# Altium schematic sheet StateMachine.SchDoc
size A4; SheetNumber: 8; SheetTotal: 12
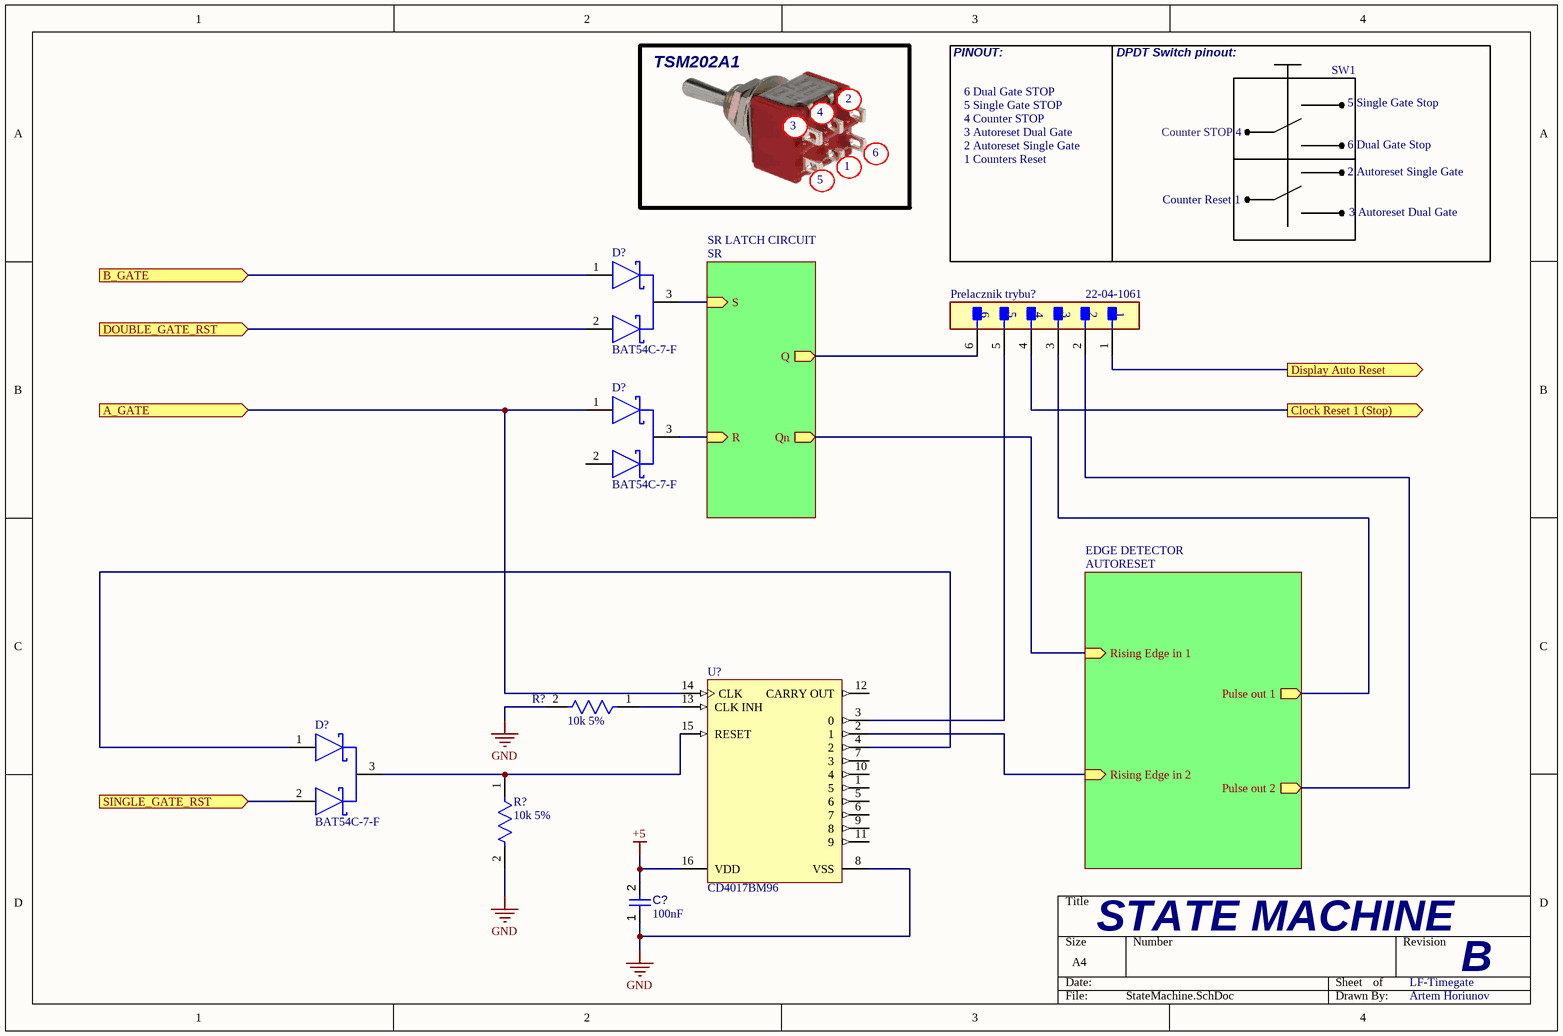
[diagram p0: StateMachine.SchDoc]

## Parts
(Parts that share a designator on the sheet are numbered #1, #2 ... from top to bottom, then left to right.)
C?  value 100nF  [CAPC2013X95X50LL10T25]  (hidden comment: Capacitor 100 nF +/-10% 50 V 0805)
D?#1  BAT54C-7-F  [FP-SOT23-IPC_B]
D?#2  BAT54C-7-F  [FP-SOT23-IPC_B]
D?#3  BAT54C-7-F  [FP-SOT23-IPC_B]
Prelacznik_trybu?  22-04-1061  [FP-22-04-1061-MFG]
R?#1  10k 5%  [FP-RC0603-0_55-IPC_C]
R?#2  10k 5%  [FP-RC0603-0_55-IPC_C]
U?  CD4017BM96  [D0016A_L]

## Sub-sheets
EDGE DETECTOR = AUTORESET: Rising Edge in 1 (in), Rising Edge in 2 (in), Pulse out 1 (out), Pulse out 2 (out)
SR LATCH CIRCUIT = SR: S (in), R (in), Q (out), Qn (out)

## Ports
A_GATE (in), B_GATE (in), Clock Reset 1 (Stop) (out), Display Auto Reset (out), DOUBLE_GATE_RST (in), SINGLE_GATE_RST (in)

## Nets
+5: C?.2 U?.16(VDD)
GND: C?.1 R?#1.2 R?#2.2 U?.8(VSS)
A_GATE: D?#2.1(1_ANODE) U?.14(CLK) ; port A_GATE
B_GATE: D?#1.1(1_ANODE) ; port B_GATE
Clock Reset 1 (Stop): Prelacznik_trybu?.4 ; port Clock Reset 1 (Stop)
Display Auto Reset: Prelacznik_trybu?.1 ; port Display Auto Reset
DOUBLE_GATE_RST: D?#1.2(2_ANODE) ; port DOUBLE_GATE_RST
SINGLE_GATE_RST: D?#3.2(2_ANODE) ; port SINGLE_GATE_RST
NetD?#1_3: D?#1.3(COMMON_CATHODE) ; sheet SR LATCH CIRCUIT/S
NetD?#2_3: D?#2.3(COMMON_CATHODE) ; sheet SR LATCH CIRCUIT/R
NetD?#3_1: D?#3.1(1_ANODE) U?.4(2)
NetD?#3_3: D?#3.3(COMMON_CATHODE) R?#2.1 U?.15(RESET)
NetPrelacznik_trybu?_2: Prelacznik_trybu?.2 ; sheet EDGE DETECTOR/Pulse out 2
NetPrelacznik_trybu?_3: Prelacznik_trybu?.3 ; sheet EDGE DETECTOR/Pulse out 1
NetPrelacznik_trybu?_5: Prelacznik_trybu?.5 U?.3(0)
NetPrelacznik_trybu?_6: Prelacznik_trybu?.6 ; sheet SR LATCH CIRCUIT/Q
NetR?#1_1: R?#1.1 U?.13(CLK_INH)
NetU?_2: U?.2(1) ; sheet EDGE DETECTOR/Rising Edge in 2
(unnamed): sheet SR LATCH CIRCUIT/Qn, sheet EDGE DETECTOR/Rising Edge in 1

Not connected (* = marked no-connect by the designer): D?#2 2(2_ANODE); U? 1(5) 5(6) 6(7) 7(3) 9(8) 10(4) 11(9) 12(CARRY_OUT)

## Notes on the sheet
- TSM202A1
- 4
- 2
- PINOUT:
- 6 Dual Gate STOP
- 5 Single Gate STOP
- DPDT Switch pinout:
- SW1
- 5 Single Gate Stop
- 3
- 1
- 6
- 4 Counter STOP
- 3 Autoreset Dual Gate
- 2 Autoreset Single Gate
- 1 Counters Reset
- Counter STOP 4
- 6 Dual Gate Stop
- 5
- Counter Reset 1
- STATE MACHINE
- LF-Timegate
- B
- Artem Horiunov

## Library data of the parts
C? = CMP-001-00018-6: Chip Capacitor, 100 nF, +/- 10%, 50 V, 0805 (2012 Metric); Capacitor Type: Ceramic; Voltage Rating: 50V; Pins: 2; Max Operating Temperature: 125°C; Min Operating Temperature: -55°C; Mounting Technology: SM; Case/Package: 0805; RoHS Compliant: True; Tolerance: 10%
D?#1-D?#3 = CMP-12790-000084-1: DIODE ARRAY SCHOTTKY 30V SOT23-3; Max Reverse Current: 2uA; Power Dissipation: 200mW; Average Rectified Current: 200mA; Capacitance: 10pF; Peak Non-Repetitive Surge Current: 600mA; Forward Voltage: 800mV; Reverse Recovery Time: 5ns; Element Configuration: Common Cathode; Max Operating Temperature: 150°C; Max Reverse Voltage (DC): 30V; Power Rating: 200mW; Termination: SMD/SMT; REACH SVHC: No SVHC; Voltage Rating (DC): 30V; Series: -; Current Rating: 200mA; RoHS Compliant: Yes; Max Power Dissipation: 200mW; Case/Package: SOT-23; Max Repetitive Reverse Voltage (Vrrm): 30V; Width: 1.3mm; Min Operating Temperature: -65°C; Lead Free: Lead Free; Forward Current: 200mA; Number of Pins: 3; Contact Plating: Tin; Package Quantity: 3000; Length: 2.9mm; Radiation Hardening: No; Max Forward Surge Current (Ifsm): 600mA; Height: 1mm; Packaging: Tape and Reel; Mount: Surface Mount; Weight: 0.000282oz
Prelacznik_trybu? = CMP-04776-000934-1: CONN HEADER VERT 6POS 2.5MM; Number of Positions: 6; Contact Resistance: 20mR; Insulation Resistance: 1GR; Glow Wire Compliant: Non-compliant; Current Rating: 3A; Max Voltage Rating (DC): 250.25kV; Voltage Rating (AC): 250V; Connector Type: Male Pin; Gender: Male; Hole Diameter: 1.19mm; Termination: Solder; Number of Circuits: 6; Number of Rows: 1; Mount: Through Hole; Lead Free: Lead Free; Contact Type: Male Pin; Lead Pitch: 2.5mm; Radiation Hardening: No; Packaging: Bulk; Pitch: 2.5mm; Contact Plating: Tin; Housing Color: Natural; Fastening Type: Friction; Contact Gender: Male; Length: 14.5mm; Orientation: Straight; Series: KK® 5045; Number of Contacts: 6; Halogen Free: Low Halogen; Min Operating Temperature: -40°C; Number of Poles: 6; Width: 5.8mm; Housing Material: Nylon; Max Operating Temperature: 105°C; Contact Material: Brass; Flammability Rating: UL94 V-0; Color: Natural; Contact Mating Length: 0.295inch; Working Voltage: 250V; Voltage Rating: 250V; Package Quantity: 1; Height: 11.7mm; Voltage Rating (DC): 250V
R?#1 R?#2 = CMP-2100-03664-2: RES 10K OHM 1% 1/10W 0603; Voltage Rating: 75V; Voltage Rating (DC): 50V; Resistance: 10kR; Power Rating: 100mW; Temperature Coefficient: 100ppm/°C; Depth: 0.8mm; Termination: SMD/SMT; Resistor Type: Thick Film; Series: RC; Construction: Rectangular; Features: Moisture Resistant; Packaging: Tape and Reel; Min Operating Temperature: -55°C; Number of Terminations: 2; Lead Pitch: 0.3mm; RoHS Compliant: Yes; Case/Package: 0603; Resistance Tolerance: 1%; Military Standard: Not; Weight: 7.1E-05oz; Number of Pins: 2; Tolerance: 1%; Length: 1.6mm; Case Code (Imperial): 0603; Lead Free: Lead Free; Width: 0.8mm; Max Power Dissipation: 100mW; Height: 0.45mm; Max Operating Temperature: 155°C; Case Code (Metric): 1608; Size Code: 0603
U? = CMP-1623-00072-2: CMOS Decade Counter with 10 Decoded Outputs, D0016A, LARGE T&R; Manufacturer: Texas Instruments; Technology Family: CD4000; Schmitt Trigger: No; VCC(Max)(V): 18; Inputs: 1; tpd @ Nom Voltage(Max)(ns): 270; Rating: Military; Bits(#): 10; Output Drive (IOL/IOH)(Max)(mA): 1.5/-1.5; ICC @ Nom Voltage(Max)(mA): 0.03; F @ Nom Voltage(Max)(Mhz): 8; VCC(Min)(V): 3; Output Type: CMOS; Operating Temperature Range(C): -55 to 125; Generic Part Number: CD4017B; Type: Decade; DatasheetVersion: SCHS027C; Input Type: CMOS; Function: Counter; PackageReference: D0016A; Code_JEDEC: MS-012 variation AC; Voltage(Nom)(V): 10